# Altium schematic sheet Источник_питанияЭ3.SchDoc: Источник питания
size 420 x 297 mm; Address1: Иванов; SheetTotal: 1; PageSetup: Record=PageOptionsZCenterHorizontal=FalseZCenterVertical=FalseZPrintScale=0.95ZXCorrection=0.00ZYCorrection=0.00ZPrintKind=1ZBorderSize=5000000ZLeftOffset=0ZBottomOffset=0ZOrientation=1ZPaperLength=1000ZPaperWidth=1000ZScale=100ZPaperSource=15ZPrintQuality=600ZMediaType=1ZDitherType=10ZPaperKind=A4ZPrintScaleMode=1; DocumentType1str: Схема электрическая; DocumentType2str: принципиальная
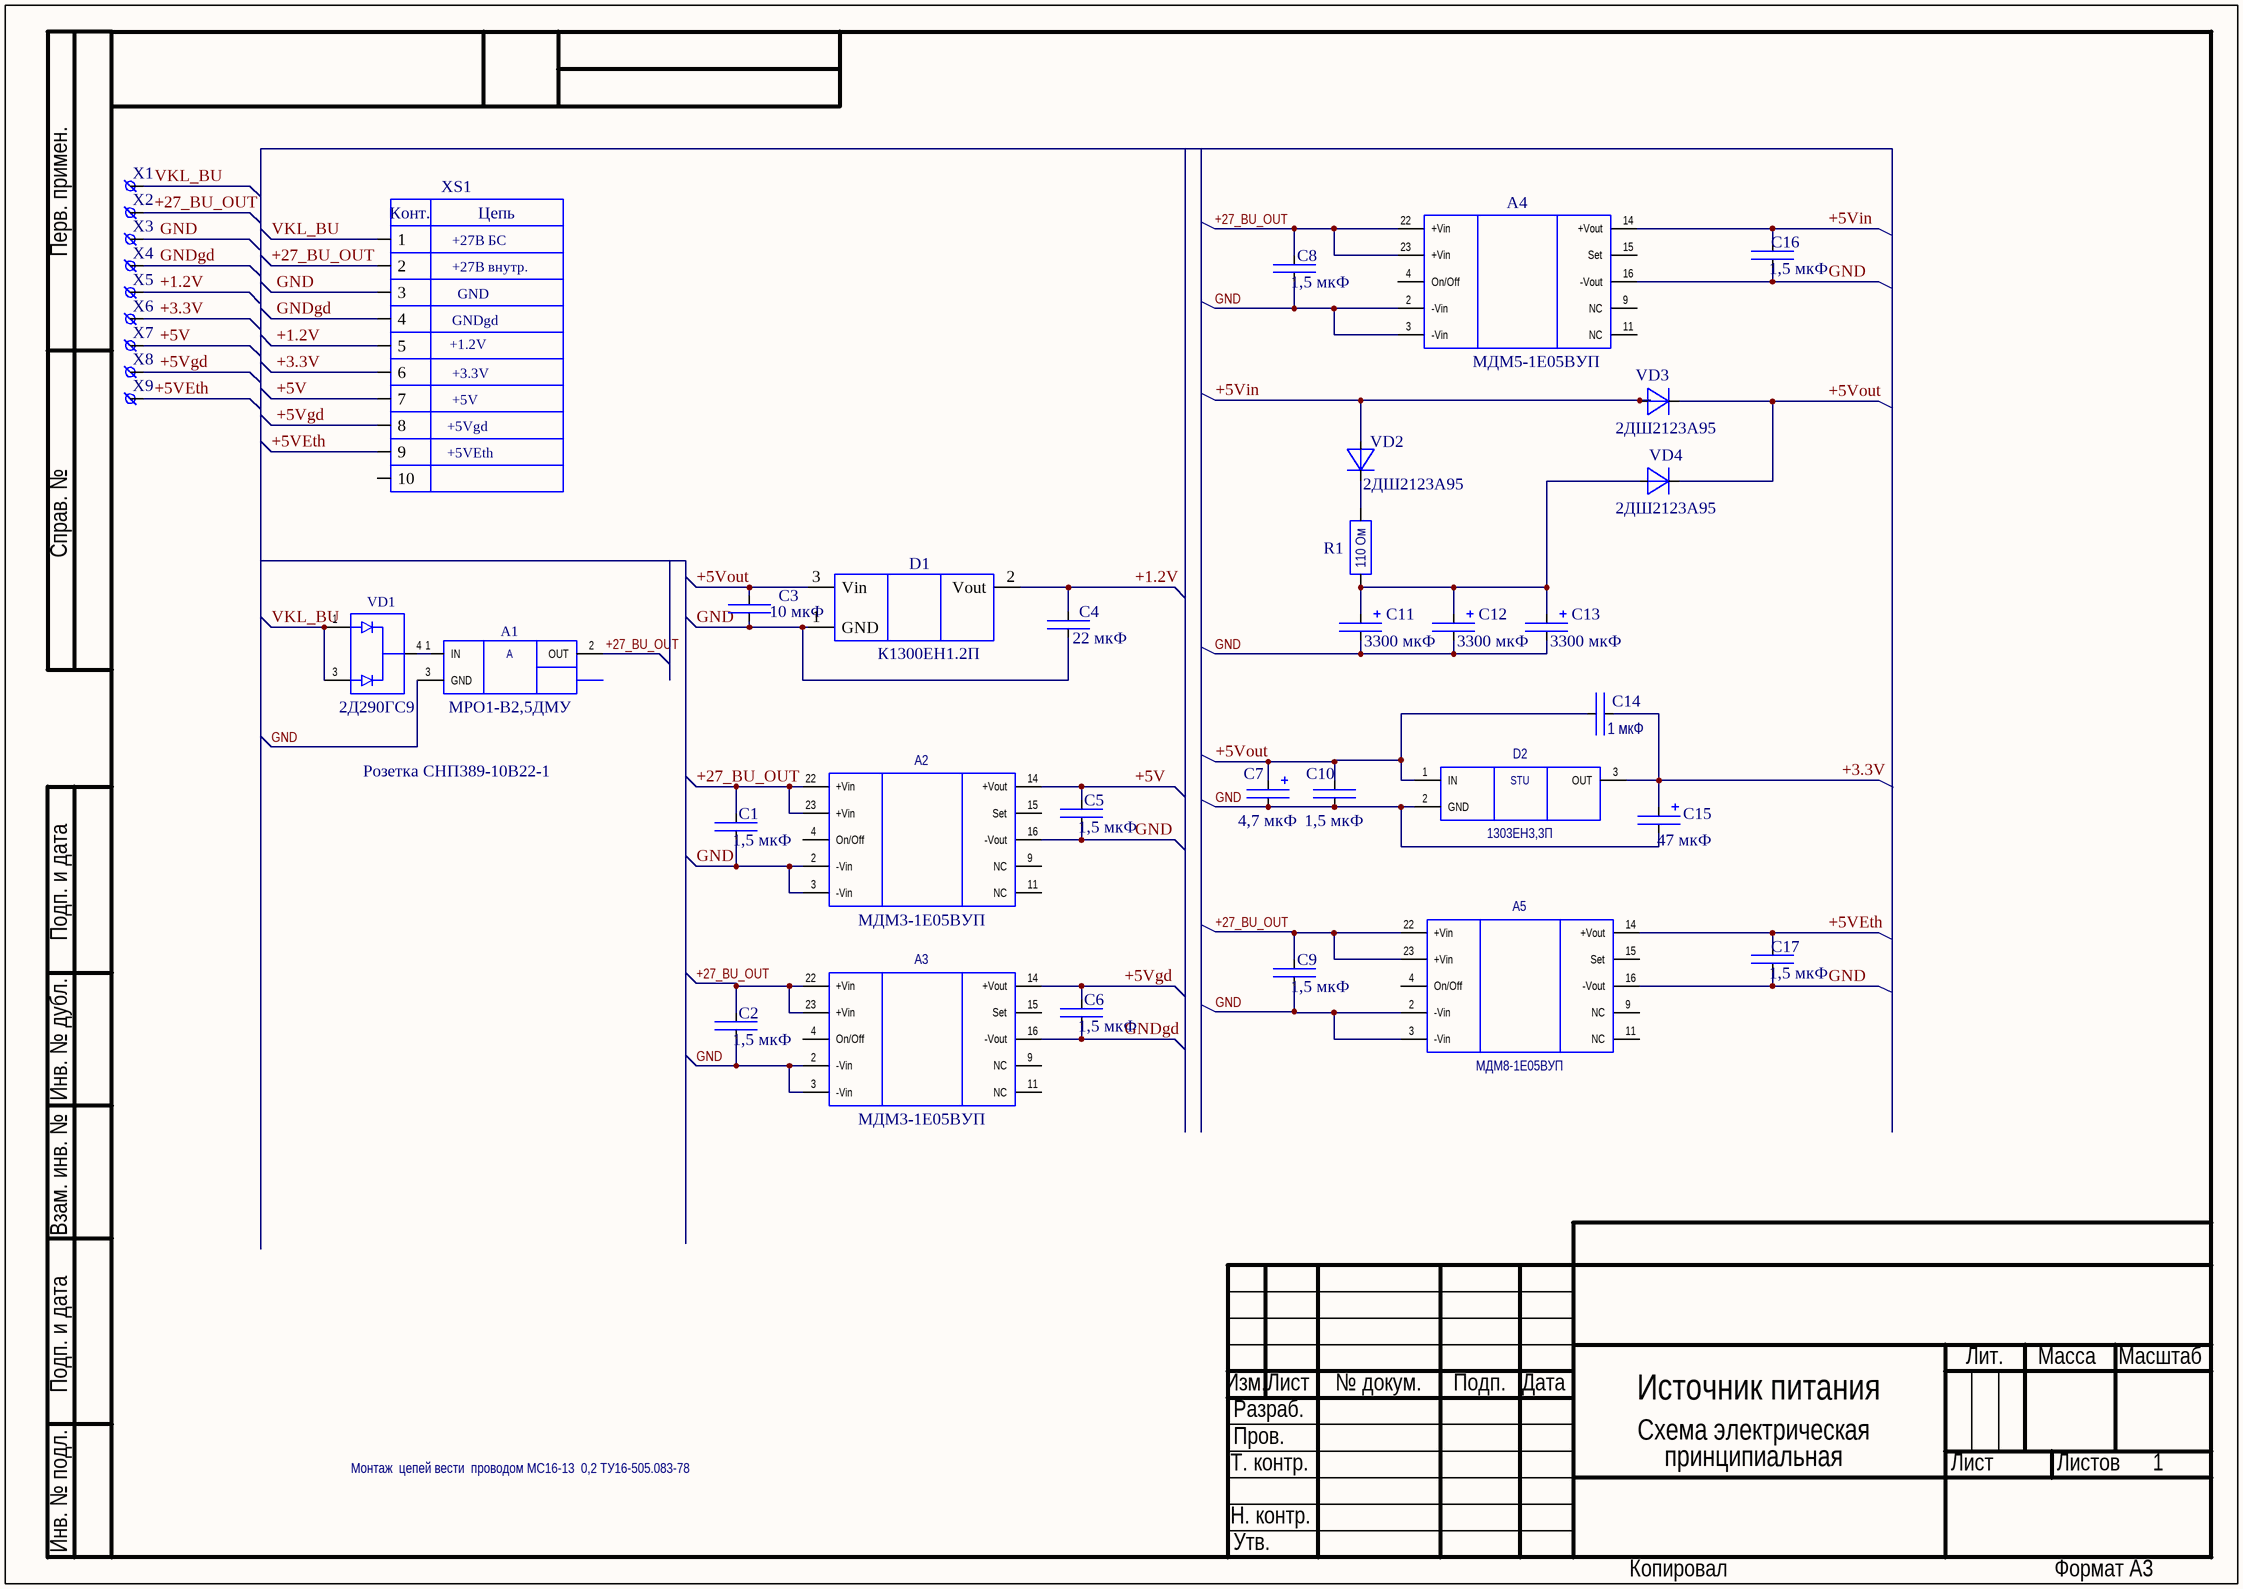
[diagram p0: Источник_питанияЭ3.SchDoc]

## Parts
A1  МРО1-В2,5ДМУ  [МРО1-У - БЕЗ ОТВ]
A2  МДМ3-1Е05ВУП  [МДМ3-Е-У]
A3  МДМ3-1Е05ВУП  [МДМ3-Е-У]
A4  PartNumber: МДМ5-1Е05ВУП  [МДМ3-Е-У]  (hidden comment: Модуль питания МДМ5-1Е05ВУП БКЮС.430609.002-01ТУ)
A5  МДМ8-1Е05ВУП  [МДМ8-Е-У_БКЮС.430609.002-01ТУ]
C1  1,5 мкФ  [K10-67_10x8x3.5]
C2  1,5 мкФ  [K10-67_10x8x3.5]
C3  10 мкФ
C4  22 мкФ
C5  1,5 мкФ  [K10-69B_4.5_3.2(1812)]
C6  1,5 мкФ  [K10-69B_4.5_3.2(1812)]
C7  4,7 мкФ  [TANTAL-A(3216)]
C8  1,5 мкФ  [K10-67_10x8x3.5]
C9  1,5 мкФ  [K10-67_10x8x3.5]
C10  1,5 мкФ  [K10-69B_4.5_3.2(1812)]
C11  3300 мкФ  [k52-18-16B-2200]
C12  3300 мкФ  [k52-18-16B-2200]
C13  3300 мкФ  [k52-18-16B-2200]
C14  1 мкФ  [K10-69B_4.5_3.2(1812)]
C15  47 мкФ  [TANTAL-C(6032)]
C16  1,5 мкФ  [K10-69B_4.5_3.2(1812)]
C17  1,5 мкФ  [K10-69B_4.5_3.2(1812)]
D1  К1300ЕН1.2П
D2  1303ЕН3,3П  [TO-220]
R1  110 Ом  [P1-12-1(2512)]
VD1  2Д290ГС9  [KT-89]
VD2  2ДШ2123А95  [KT-99-1]
VD3  2ДШ2123А95  [KT-99-1]
VD4  2ДШ2123А95  [KT-99-1]
X1  CONT  [Пл.площ.3х1.25]  (value not drawn)
X2  CONT  [Пл.площ.3х1.25]  (value not drawn)
X3  CONT  [Пл.площ.3х1.25]  (value not drawn)
X4  CONT  [Пл.площ.3х1.25]  (value not drawn)
X5  CONT  [Пл.площ.3х1.25]  (value not drawn)
X6  CONT  [Пл.площ.3х1.25]  (value not drawn)
X7  CONT  [Пл.площ.3х1.25]  (value not drawn)
X8  CONT  [Пл.площ.3х1.25]  (value not drawn)
X9  CONT  [Пл.площ.3х1.25]  (value not drawn)
XS1  Розетка СНП389-10В22-1

## Nets
+1.2V: C4.1 D1.2(Vout) X5.1 XS1.5
+3.3V: C14.1 C15.1 D2.3(OUT) X6.1 XS1.6
+5V: A2.14(+Vout) C5.1 X7.1 XS1.7
+5VEth: A5.14(+Vout) C17.1 X9.1 XS1.9
+5Vgd: A3.14(+Vout) C6.1 X8.1 XS1.8
+5Vin: A4.14(+Vout) C16.1 VD2.2 VD3.2
+5Vout: C3.1 C7.1 C10.2 C14.2 D1.3(Vin) D2.1(IN) VD3.3 VD4.3
+27_BU_OUT: A1.2(OUT) A2.22(+Vin) A2.23(+Vin) A3.22(+Vin) A3.23(+Vin) A4.22(+Vin) A4.23(+Vin) A5.22(+Vin) A5.23(+Vin) C1.1 C2.1 C8.1 C9.1 X2.1 XS1.2
GND: A1.3(GND) A2.2(-Vin) A2.3(-Vin) A2.16(-Vout) A3.2(-Vin) A3.3(-Vin) A4.2(-Vin) A4.3(-Vin) A4.16(-Vout) A5.2(-Vin) A5.3(-Vin) A5.16(-Vout) C1.2 C2.2 C3.2 C4.2 C5.2 C7.2 C8.2 C9.2 C10.1 C11.2 C12.2 C13.2 C15.2 C16.2 C17.2 D1.1(GND) D2.2(GND) X3.1 XS1.3
GNDgd: A3.16(-Vout) C6.2 X4.1 XS1.4
VKL_BU: VD1.1 VD1.3 X1.1 XS1.1
NetA1_1: A1.1(IN) VD1.4
NetC11_1: C11.1 C12.1 C13.1 R1.1 VD4.2
NetR1_2: R1.2 VD2.3

Not connected (* = marked no-connect by the designer): A2 4(On/Off) 9(NC) 11(NC) 15(Set); A3 4(On/Off) 9(NC) 11(NC) 15(Set); A4 4(On/Off) 9(NC) 11(NC) 15(Set); A5 4(On/Off) 9(NC) 11(NC) 15(Set); XS1 10

## Notes on the sheet
- +27В БС
- GNDgd
- +27В внутр.
- GND
- +1.2V
- +3.3V
- +5Vgd
- +5VEth
- +5V
- Монтаж  цепей вести  проводом МС16-13  0,2 ТУ16-505.083-78
- Перв. примен.
- Справ. №
- Подп. и дата
- Инв. № дубл.
- Взам. инв. №
- Изм.
- Лист
- № докум.
- Подп.
- Дата
- Лит.
- Масса
- Масштаб
- Т. контр.
- Пров.
- Разраб.
- Листов
- Инв. № подл.
- Н. контр.
- Утв.
- Копировал
- Формат А3
- (in symbol 10-Pin) Конт.; Цепь
- (in symbol 1303ЕН3,3П) STU
- (in symbol МРО) A

## Library data of the parts
A1 = МРО: Модуль защиты и фильтрации; TU: БКЮС.468240.003-01ТУ; TUHolder: ООО "АЛЕКСАНДЕР ЭЛЕКТРИК ИСТОЧНИКИ ЭЛЕКТРОПИТАНИЯ", Россия, г. Москва; TypePrefix: Модуль питания; _PE: МРО1-В2,5ДМУ БКЮС.468240.003-01ТУ; PartNumber: МРО1-В2,5ДМУ
A2 A3 A5 = МДМ3-1Е3.3ВП: TU: БКЮС.430609.002-01ТУ; TUHolder: ООО "АЛЕКСАНДЕР ЭЛЕКТРИК ИСТОЧНИКИ ЭЛЕКТРОПИТАНИЯ", Россия, г. Москва; TypePrefix: Модуль питания
  A2 A3: PartNumber: МДМ3-1Е05ВУП
  A5: PartNumber: МДМ8-1Е05ВУП
A4 = МДМ3-1Е3.3ВП: TUHolder: ООО "АЛЕКСАНДЕР ЭЛЕКТРИК ИСТОЧНИКИ ЭЛЕКТРОПИТАНИЯ", Россия, г. Москва; TU: БКЮС.430609.002-01ТУ; TypePrefix: Модуль питания
C1 = К10-69: Керамический чип-конденсатор серии К10-79; PartNumber: К10-67-Н50-100В-1,5 мкФ ±20% луженые; TU: АЖЯР.673511.003ТУ; TUHolder: ОАО "НИИ "ГИРИКОНД", Россия, г. Санкт-Петербург; _PE: К10-67-Н50-100В-1,5 мкФ ±20% луженые АЖЯР.673511.003ТУ; TypePrefix: Конденсатор; Value: 1,5 мкФ
C2 C8 C9 = К10-69: Керамический чип-конденсатор серии К10-79; PartNumber: К10-67-Н50-100В-1,5 мкФ ±20% луженые; TU: АЖЯР.673511.003ТУ; TUHolder: ОАО "НИИ "ГИРИКОНД", Россия, г. Санкт-Петербург; TypePrefix: Конденсатор; Value: 1,5 мкФ
C3 C4 = К10-69: Керамический чип-конденсатор серии К10-79; PartNumber: К10-69в-*-* В- * ± *% *; TypePrefix: C; TU: АЖЯР.673511.002ТУ; TUHolder: ОАО НИИ "ГИРИКОНД"; Value: *; PackegeType: *
C5 C6 C10 C16 C17 = К10-69: Керамический чип-конденсатор серии К10-79; PartNumber: К10-69в-Н90-25В-1,5 мкФ ±20% (4532М) луженые; TU: АЖЯР.673511.002ТУ; TUHolder: ОАО "НИИ "ГИРИКОНД", Россия, г. Санкт-Петербург; TypePrefix: Конденсатор; Value: 1,5 мкФ
C7 = К53-67: Оксидно-полупроводниковый танталовый чип-конденсатор серии К53-68; PartNumber: К53-68 "A" 10В-4,7 мкФ ±10%; TU: АЖЯР.673546.006 ТУ; TUHolder: ОАО "НИИ "ГИРИКОНД", Россия, г. Санкт-Петербург; Value: 4,7 мкФ; TypePrefix: Конденсатор
C11-C13 = К53-67: Оксидно-полупроводниковый танталовый чип-конденсатор серии К53-68; PartNumber: К52-18-10В-3300 мкФ ±20%; TU: АЖЯР.673543.004ТУ; TUHolder: ОАО "ЭЛЕКОНД", Россия, г. Сарапул; Value: 3300 мкФ; TypePrefix: Конденсатор
C14 = К10-69: Керамический чип-конденсатор серии К10-79; PartNumber: К10-69в-Н90-25В-1 мкФ ±20% (4532М луженые; TU: АЖЯР.673511.002ТУ; TUHolder: ОАО "НИИ "ГИРИКОНД", Россия, г. Санкт-Петербург; Value: 1 мкФ; TypePrefix: Конденсатор
C15 = К53-67: Оксидно-полупроводниковый танталовый чип-конденсатор серии К53-68; PartNumber: К53-68 "C" 10В-47 мкФ ±10%; TU: АЖЯР.673546.006 ТУ; TUHolder: ОАО "НИИ "ГИРИКОНД", Россия, г. Санкт-Петербург; Value: 47 мкФ; TypePrefix: Конденсатор
D2 = 1303ЕН3,3П: TUHolder: ОАО "НПП "ЭлТом", Россия, Мос. обл., п.г.т.Томилино; TypePrefix: Микросхема; TU: АЕЯР.431420.638ТУ; PartNumber: 1303ЕН3,3П
R1 = Р1-12: Постоянные непроволочные безвыводные резисторы общего применения Р1-12; PartNumber: Р1-12-1-110 Ом±5 %-T; TU: АЛЯР.434110.005ТУ; TUHolder: ОАО "НПО "ЭРКОН", Россия, г. Нижний Новгород; TypePrefix: Резистор; Value: 110 Ом
VD1 = 2Д290ГС9: Диод 2Д290ГС9; TU: АЕЯР.432120.217ТУ; TUHolder: АО "ВЗПП-С", Россия, г. Воронеж; _PE: 2Д290ГС9 АЕЯР.432120.217ТУ; PartNumber: 2Д290ГС9; TypePrefix: Диод; Value: 2Д290ГС9
VD2-VD4 = 2ДШ2123А95: Диод Шоттки; TU: АЕЯР.432120.567ТУ; TUHolder: ОА ВЗПП-С; TypePrefix: VD; PackegeType: КТ-99-1; Value: *; PartNumber: 2ДШ2123А95
X1-X9 = CONT: CONT1_SMD; PartNumber: контактное поле; Value: *
XS1 = 10-Pin: Розетка 10 контактов; TU: РЮМК.430420.033ТУ; TUHolder: АО "Карачевский завод Электродеталь", Россия, г. Карачев; PartNumber: Розетка СНП389-10В22-1